# Altium schematic sheet Input Level.SchDoc
size A
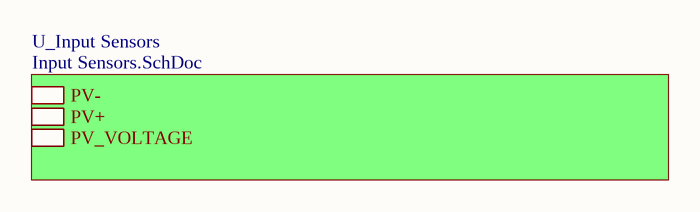
[diagram p0: Input Level.SchDoc]

## Sub-sheets
U_Input Sensors = Input Sensors.SchDoc: PV-, PV+, PV_VOLTAGE